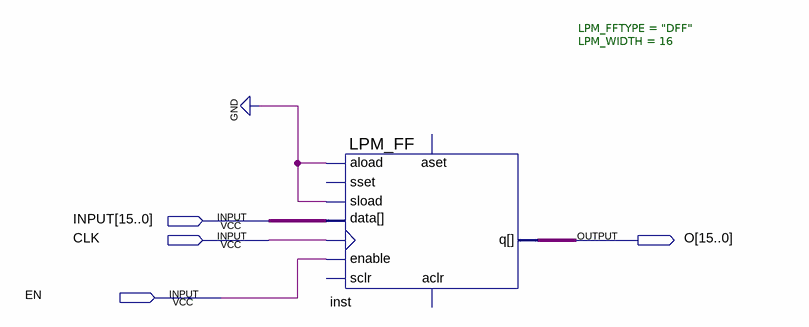
[diagram p0: schematic sheet]
// Quartus schematic regbank_16bFF.bdf as structural Verilog: 1 symbols, 4 pins
module regbank_16bFF (
  input  [15:0] INPUT,
  input  CLK,
  input  EN,
  output [15:0] O
);

  LPM_FF #(.LPM_FFTYPE("DFF"), .LPM_WIDTH(16)) inst (
    .enable(EN), .clock(CLK), .aload(1'b0), .sload(1'b0), .data(INPUT), .q(O));  // open: sset, aset, sclr, aclr
endmodule
